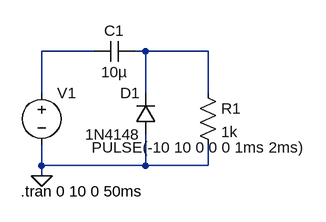
[diagram p0: schematic Retificador de meia onda.asc]
Retificador de meia onda.asc, the LTspice schematic file:
Version 4
SHEET 1 880 680
WIRE 144 80 64 80
WIRE 224 80 208 80
WIRE 320 80 224 80
WIRE 64 144 64 80
WIRE 224 144 224 80
WIRE 320 144 320 80
WIRE 64 256 64 224
WIRE 224 256 224 208
WIRE 224 256 64 256
WIRE 320 256 320 224
WIRE 320 256 224 256
WIRE 64 272 64 256
FLAG 64 272 0
SYMBOL voltage 64 128 R0
WINDOW 3 77 100 Left 2
WINDOW 123 0 0 Left 0
WINDOW 39 0 0 Left 0
SYMATTR Value PULSE(-10 10 0 0 0 1ms 2ms)
SYMATTR InstName V1
SYMBOL cap 208 64 R90
WINDOW 0 0 32 VBottom 2
WINDOW 3 32 32 VTop 2
SYMATTR InstName C1
SYMATTR Value 10µ
SYMBOL diode 240 208 R180
WINDOW 0 24 64 Left 2
WINDOW 3 24 0 Left 2
SYMATTR InstName D1
SYMATTR Value 1N4148
SYMBOL res 304 128 R0
SYMATTR InstName R1
SYMATTR Value 1k
TEXT 32 296 Left 2 !.tran 0 10 0 50ms

The netlist it stands for:
* Retificador de meia onda.asc
V1 N001 0 PULSE(-10 10 0 0 0 1ms 2ms)
C1 N002 N001 10µ
D1 0 N002 1N4148
R1 N002 0 1k
.model D D
.lib standard.dio
.tran 0 10 0 50ms
.backanno
.end